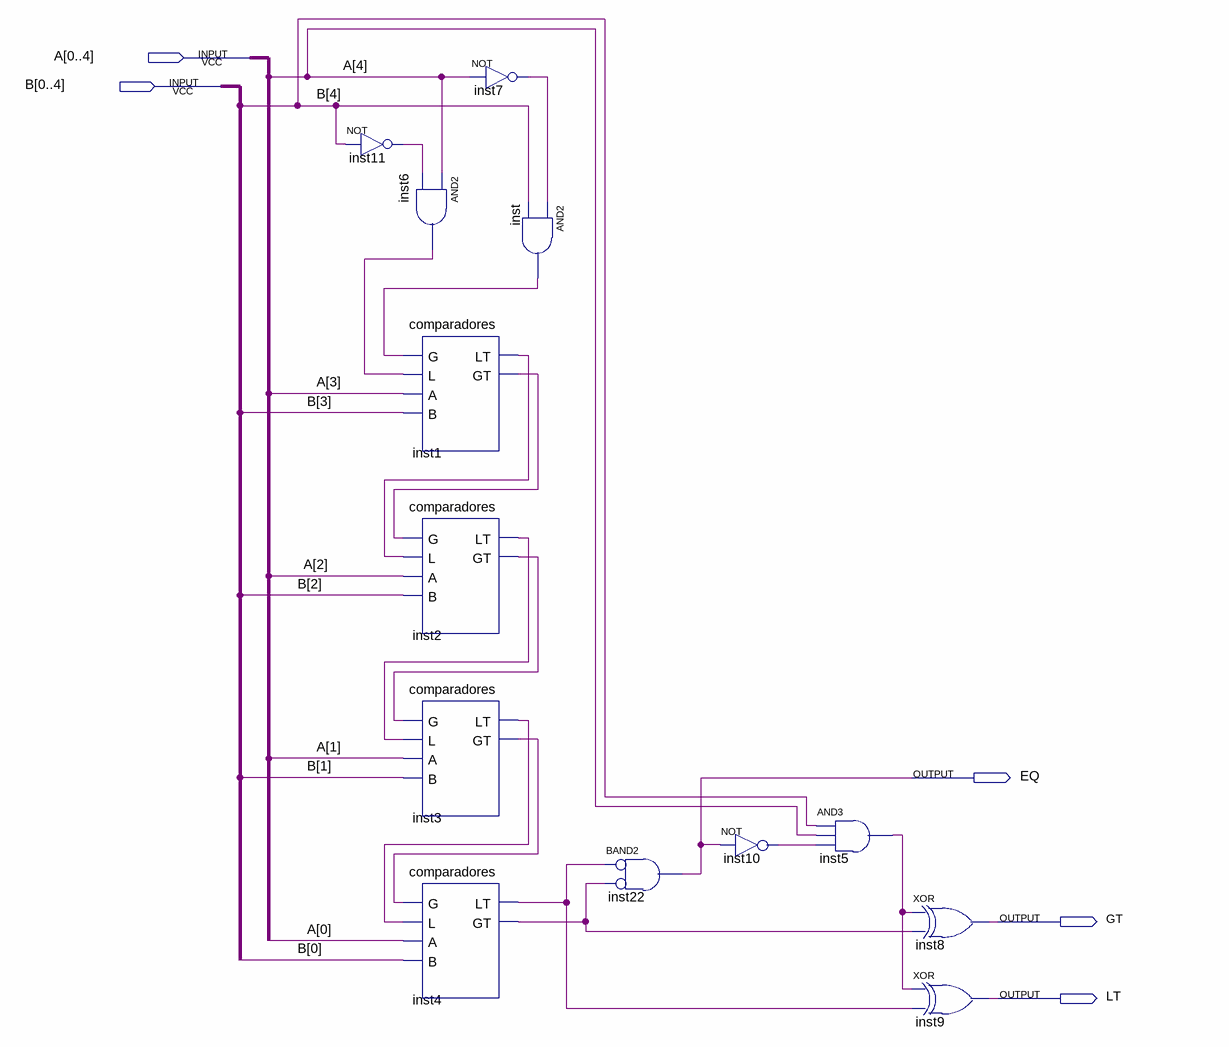
[diagram p0: schematic sheet]
// Quartus schematic comparador.bdf as structural Verilog: 13 symbols, 5 pins
module comparador (
  input  [0:4] A,
  input  [0:4] B,
  output EQ,
  output GT,
  output LT
);

  wire inst1_gt, inst1_lt, inst2_gt, inst2_lt, inst3_gt, inst3_lt, inst4_gt, inst4_lt, inst5_out, inst6_out,
       inst7_out, inst10_out, inst11_out, inst_out;

  not inst11 (inst11_out, B[4]);
  and inst6 (inst6_out, A[4], inst11_out);
  comparadores inst1 (.G(inst_out), .L(inst6_out), .A(A[3]), .B(B[3]), .LT(inst1_lt), .GT(inst1_gt));
  comparadores inst2 (.G(inst1_gt), .L(inst1_lt), .A(A[2]), .B(B[2]), .LT(inst2_lt), .GT(inst2_gt));
  comparadores inst3 (.G(inst2_gt), .L(inst2_lt), .A(A[1]), .B(B[1]), .LT(inst3_lt), .GT(inst3_gt));
  comparadores inst4 (.G(inst3_gt), .L(inst3_lt), .A(A[0]), .B(B[0]), .LT(inst4_lt), .GT(inst4_gt));
  not inst7 (inst7_out, A[4]);
  and inst (inst_out, inst7_out, B[4]);
  and inst22 (EQ, ~inst4_lt, ~inst4_gt);  // BAND2
  not inst10 (inst10_out, EQ);
  and inst5 (inst5_out, B[4], A[4], inst10_out);
  xor inst8 (GT, inst5_out, inst4_gt);
  xor inst9 (LT, inst5_out, inst4_lt);
endmodule
